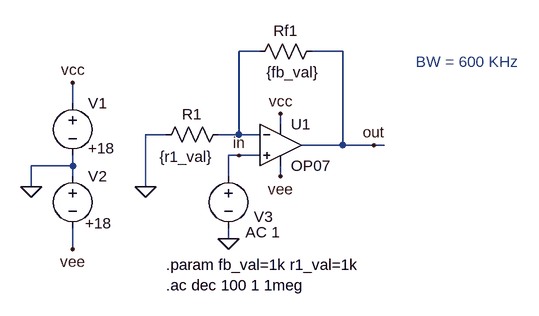
[diagram p0: schematic 08-non_inverting_amplifier_bode.asc]
08-non_inverting_amplifier_bode.asc, the LTspice schematic file:
Version 4
SHEET 1 880 680
WIRE 320 -64 288 -64
WIRE 448 -64 400 -64
WIRE 32 16 32 -16
WIRE 352 48 352 32
WIRE 176 64 144 64
WIRE 288 64 288 -64
WIRE 288 64 256 64
WIRE 320 64 288 64
WIRE 448 80 448 -64
WIRE 448 80 384 80
WIRE 496 80 448 80
WIRE 512 80 496 80
WIRE 288 96 272 96
WIRE 320 96 288 96
WIRE 32 112 32 96
WIRE 32 112 -32 112
WIRE 32 128 32 112
WIRE 272 128 272 96
WIRE 352 128 352 112
WIRE -32 144 -32 112
WIRE 144 144 144 64
WIRE 272 224 272 208
WIRE 32 240 32 208
FLAG -32 144 0
FLAG 32 -16 vcc
FLAG 32 240 vee
FLAG 144 144 0
FLAG 288 96 in
FLAG 352 128 vee
FLAG 352 32 vcc
FLAG 496 80 out
FLAG 272 224 0
SYMBOL OpAmps\\OP07 352 16 R0
SYMATTR InstName U1
SYMBOL voltage 32 0 R0
WINDOW 3 24 85 Left 2
WINDOW 123 0 0 Left 0
WINDOW 39 0 0 Left 0
SYMATTR Value +18
SYMATTR InstName V1
SYMBOL voltage 32 112 R0
WINDOW 3 19 88 Left 2
WINDOW 123 0 0 Left 0
WINDOW 39 0 0 Left 0
SYMATTR Value +18
SYMATTR InstName V2
SYMBOL voltage 272 112 R0
WINDOW 0 39 78 Left 2
WINDOW 3 20 91 Left 2
WINDOW 123 26 102 Left 2
WINDOW 39 0 0 Left 0
SYMATTR InstName V3
SYMATTR Value ""
SYMATTR Value2 AC 1
SYMBOL res 416 -80 R90
WINDOW 0 0 56 VBottom 2
WINDOW 3 32 45 VTop 2
SYMATTR InstName Rf1
SYMATTR Value {fb_val}
SYMBOL res 272 48 R90
WINDOW 0 0 56 VBottom 2
WINDOW 3 34 65 VTop 2
SYMATTR InstName R1
SYMATTR Value {r1_val}
TEXT 176 264 Left 2 !.param fb_val=1k r1_val=1k
TEXT 176 296 Left 2 !.ac dec 100 1 1meg
TEXT 560 -48 Left 2 ;BW = 600 KHz

The netlist it stands for:
* 08-non_inverting_amplifier_bode.asc
XU1 in N001 vcc vee out LT1001  ; OP07, pins In+ In- V+ V- OUT
V1 vcc 0 +18
V2 0 vee +18
V3 in 0 AC 1
Rf1 out N001 {fb_val}
R1 N001 0 {r1_val}
.param fb_val=1k r1_val=1k
.ac dec 100 1 1meg
* BW = 600 KHz
.lib LTC.lib
.backanno
.end

* Results of the author's LTspice run, read from the files saved beside the schematic
* Operating Point, zero values left out:
*   V(vcc) = 18 V
*   V(vee) = -18 V
*   I(V1) = -2.25 mA
*   I(V2) = -2.25 mA
*   Ix(u1:3) = 2.25 mA
*   Ix(u1:4) = -2.25 mA